# Altium schematic sheet asynchronous.SchDoc
size 152 x 127 mm; SheetNumber: 5; SheetTotal: 6
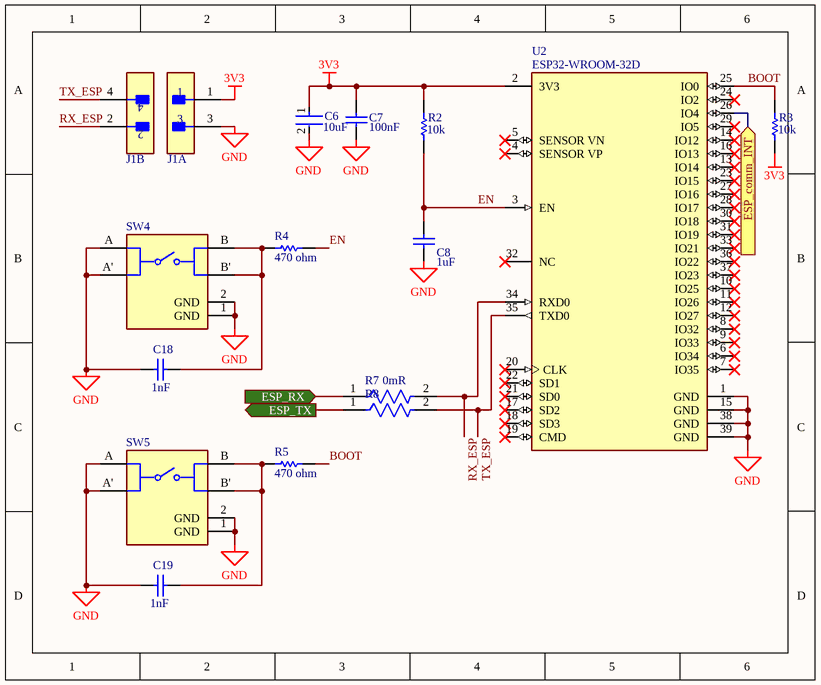
[diagram p0: asynchronous.SchDoc]

## Parts
C6  Capacitance: 10uF  [FP-1206-L_3_2_0_2-W_1_6_0-IPC_B]  (hidden comment: 1206YD106KAT2A)
C7  value 100nF  [CAPC2013X140X50LL20T25]  (hidden comment: 08055F104KAT2A)
C8  Parameter 1: 1uF  [CAPC2013X145X50LL20T25]  (hidden comment: C0805C105K4PACTU)
C18  Parameter 1: 1nF  [CAPC2013X145X48LL20T23]  (hidden comment: VJ0805D102KXAAJ)
C19  Parameter 1: 1nF  [CAPC2013X145X48LL20T23]  (hidden comment: VJ0805D102KXAAJ)
J1  PEC02DABN  [FP-PEC02DABN-MFG]  (value not drawn)  (parts A,B of 2)
R2  Parameter 1: 10k  [RESC2013X60X35NL10T20]  (hidden comment: RC0805FR-0710KL)
R3  Parameter 1: 10k  [RESC2013X60X35NL10T20]  (hidden comment: RC0805FR-0710KL)
R4  Parameter 1: 470 ohm  [RESC2013X50X30LL20T20]  (hidden comment: CRCW0805470RFKEA)
R5  Parameter 1: 470 ohm  [RESC2013X50X30LL20T20]  (hidden comment: CRCW0805470RFKEA)
R7  Resistance: 0mR  [FP-CR0805-IPC_C]  (hidden comment: CR0805-J/-000ELF)
R8  CR0805-J/-000ELF  [FP-CR0805-IPC_C]  (value not drawn)
SW4  EVQ-PLMA15  [FP-EVQ-PLMA15-MFG]  (value not drawn)
SW5  EVQ-PLMA15  [FP-EVQ-PLMA15-MFG]  (value not drawn)
U2  ESP32-WROOM-32D  [FP-ESP32-WROOM-32D-MFG]

## Ports
ESP_comm_INT (in), ESP_RX (in, see Top_domain[4F]), ESP_TX (out, see Top_domain[6G])

## Nets
3V3: C6.1 C7.2 J1.1 R2.2 R3.1 U2.2(3V3)
GND: C6.2 C7.1 C8.1 C18.1 C19.1 J1.3 SW4.1(GND) SW4.2(GND) SW4.A SW4.A' SW5.1(GND) SW5.2(GND) SW5.A SW5.A' U2.1(GND) U2.15(GND) U2.38(GND) U2.39(GND)
BOOT: R3.2 R5.2 U2.25(IO0)
EN: C8.2 R2.1 R4.2 U2.3(EN)
ESP_comm_INT: U2.26(IO4) ; port ESP_comm_INT
ESP_RX: R7.1 ; port ESP_RX
ESP_TX: R8.1 ; port ESP_TX
RX_ESP: J1.2 R7.2 U2.34(RXD0)
TX_ESP: J1.4 R8.2 U2.35(TXD0)
NetC18_2: C18.2 R4.1 SW4.B SW4.B'
NetC19_2: C19.2 R5.1 SW5.B SW5.B'

Not connected (* = marked no-connect by the designer): U2 4(SENSOR_VP)* 5(SENSOR_VN)* 6(IO34)* 7(IO35)* 8(IO32)* 9(IO33)* 10(IO25)* 11(IO26)* 12(IO27)* 13(IO14)* 14(IO12)* 16(IO13)* 17(SD2)* 18(SD3)* 19(CMD)* 20(CLK)* 21(SD0)* 22(SD1)* 23(IO15)* 24(IO2)* 27(IO16)* 28(IO17)* 29(IO5)* 30(IO18)* 31(IO19)* 32(NC)* 33(IO21)* 36(IO22)* 37(IO23)*

## Library data of the parts
C6 = CMP-04427-000082-1: General Purpose Ceramic Capacitor, 1206, 10uF, 10%, X5R, 15%, 16V; Max Operating Temperature: 85°C; Tolerance: 10%; Dielectric: X5R; Series: -; Case Code (Imperial): 1206; Width: 1.6mm; Termination: SMD/SMT; Voltage Rating: 16V; REACH SVHC: No SVHC; Length: 3.2mm; Size: 1.78mm; Package Quantity: 1; Voltage: 16V; RoHS Compliant: Yes; Thickness: 0.07inch; Mount: Surface Mount; Radiation Hardening: No; Voltage Rating (DC): 16V; Min Operating Temperature: -55°C; Case Code (Metric): 3216; Construction: Flat; Depth: 1.6mm; Height: 0.07mm; Lead Free: Lead Free; Number of Pins: 2; Case/Package: 1206; Packaging: Tape and Reel
C7 = CMP-2007-04784-1: Manufacturer: AVX Interconnect / Elco; Part Number: 08055F104KAT2A
C8 = CMP-1036-04746-2: Manufacturer: Kemet; Part Number: C0805C105K4PACTU
C18 C19 = CMP-2007-03135-1: Manufacturer: Vitramon; Part Number: VJ0805D102KXAAJ
J1 = CMP-25680-000069-1: CONN HEADER VERT 4POS 2.54MM; Number of Contacts: 4; Row Spacing: 0.1inch; Connector Type: Male Pin; Gender: Male; Series: -; Housing Material: Plastic; Contact Material: Bronze; Length: 5.08mm; RoHS Compliant: Yes; Width: 5.08mm; Min Operating Temperature: -65°C; Contact Shape: Square; Pitch: 0.1inch; Lead Free: Lead Free; Number of Positions: 4; Fastening Type: Pull; Contact Plating: Tin; Flammability Rating: UL94 V-0; Packaging: Bulk; Termination: Solder; Max Operating Temperature: 125°C; Package Quantity: 1; Number of Rows: 2; Contact Mating Length: 0.23inch; Contact Finish - Mating: TIN; Height: 2.54mm; Insulation Color: Black; Mount: Through Hole; Insulation Material: PBT; Color: Black; Housing Color: Black; Contact Type: Male Pin
R2 R3 = CMP-1659-00013-4: Chip Resistor, 10 KOhm, +/- 1%, 0.125 W, -55 to 155 degC, 0805 (2012 Metric), RoHS, Tape and Reel; Manufacturer: Yageo; Voltage Rating: 150 V; Mount: Surface Mount; ComponentLink1Description: Manufacturer URL; ComponentLink2URL: http://www.yageo.com/documents/recent/PYu-RC_Group_51_RoHS_L_04.pdf; Pins: 2; Length: 2 mm; Min Operating Temperature: -55 degC; Height: 0.5 mm; Mounting Technology: Surface Mount; RoHSCompliant: true; REACH SVHC: No SVHC; ComponentLink1URL: http://www.yageo.com/; Max Operating Temperature: 155 degC; PackageReference: 0805; DatasheetVersion: Rev. 4, 02/2016; Package Quantity: 5000; Packaging: Tape and Reel; ComponentLink2Description: Datasheet; PackageDescription: 2-Pin Surface Mounted Device, Body 2 x 1.25 mm
R4 R5 = CMP-2001-03932-1: Manufacturer: Vishay Dale; Part Number: CRCW0805470RFKEA
R7 = CMP-07231-004348-1: Thick Film Chip Resistors 0805 0Ω 0.125W 5%; Voltage Rating: 150V; Max Power Dissipation: 125mW; Temperature Coefficient: 500ppm/°C; Min Operating Temperature: -55°C; Case Code (Metric): 2012; Height: 0.5mm; Contact Plating: Tin; Thickness: 508um; Military Standard: Not; Composition: Thick Film; REACH SVHC: No SVHC; Voltage Rating (DC): 150V; Length: 2mm; Radiation Hardening: No; Case/Package: 0805; Package Quantity: 5000; Number of Pins: 2; Max Operating Temperature: 155°C; Case Code (Imperial): 0805; Mount: Surface Mount; Depth: 1.25mm; Packaging: Tape and Reel; Tolerance: 5%; Termination: SMD/SMT; Width: 1.25mm; Power Rating: 125mW
R8 = CMP-07231-004348-1: Thick Film Chip Resistors 0805 0Ω 0.125W 5%; Voltage Rating: 150V; Max Power Dissipation: 125mW; Temperature Coefficient: 500ppm/°C; Resistance: 0mR; Min Operating Temperature: -55°C; Case Code (Metric): 2012; Height: 0.5mm; Contact Plating: Tin; Thickness: 508um; Military Standard: Not; Composition: Thick Film; REACH SVHC: No SVHC; Voltage Rating (DC): 150V; Length: 2mm; Radiation Hardening: No; Case/Package: 0805; Package Quantity: 5000; Number of Pins: 2; Max Operating Temperature: 155°C; Case Code (Imperial): 0805; Mount: Surface Mount; Depth: 1.25mm; Packaging: Tape and Reel; Tolerance: 5%; Termination: SMD/SMT; Width: 1.25mm; Power Rating: 125mW
SW4 SW5 = CMP-05618-000006-1: SWITCH TACTILE SPST-NO 0.02A 15V; Manufacturer: Panasonic Electronic Components; Operating Force: 2.6N; Contact Resistance: 50mΩ; Contact Current Rating: 20mA; Electromechanical Life: 200000Cycles; Throw Configuration: SPST-NO; Automotive: No; Digikey Description: SWITCH TACTILE SPST-NO 0.02A 15V; Device Class L3: Tactile Switches; Device Class L2: Switches; Temperature Range Low: -20°C; ComponentLink2Description: Datasheet; RoHS: TRUE; Mount: Surface Mount; Package: 0; Height: 1.7mm; Octopart: https://octopart.com/evq-plma15-panasonic-39850235; Temperature Range High: +70°C; Device Class L1: Electromechanical; Category: Switch; Mouser Description: Tactile Switches FLAT ACT 2.6NF 4.6x3.4x1.5mm; Voltage Rating Dc: 15V; Manufacturer Part Number: EVQ-PLMA15; ComponentLink2URL: https://datasheet.ciiva.com/8164/atv0000ce2-8164994.pdf; Lead Free: Yes; Temperature: -20°C to +70°C
U2 = CMP-194065-000003-1: WIFI MODULE 32MBITS SPI FLASH; Manufacturer: Espressif Systems; Max Supply Voltage: 3.6V; Nominal Supply Current: 500mA; Max Frequency: 2484MHz; Number Of Adc Channels: 16; Number Of Gpio: 32; Interface: I2C,SPI,UART,Ethernet,I2S,Other; Data Rate: 150Mbits/s; Min Supply Voltage: 3V; Bandwidth: 72MHz; Sensitivity: -98dBm; Octopart: https://octopart.com/esp32-wroom-32d-espressif+systems-91040050; Package: ESP32-WROOM-32D; ComponentLink2URL: https://www.espressif.com/sites/default/files/documentation/esp32-wroom-32d_esp32-wroom-32u_datasheet_en.pdf; Lead Free: Yes; Category: UNK; Mouser Description: Wi-Fi/BT BLE Module ESP32-D0WD, SPI Flash, UART, P; Device Class L1: Integrated Circuits (ICs); RoHS: TRUE; Temperature Range Low: -40°C; ComponentLink2Description: Datasheet; Digikey Description: WIFI MODULE 32MBITS SPI FLASH; Height: 3.2mm; Temperature: -40°C to +85°C; Manufacturer Part Number: ESP32-WROOM-32D; Device Class L3: Transceivers; Device Class L2: RF Semiconductors and Devices; Temperature Range High: +85°C; Automotive: No